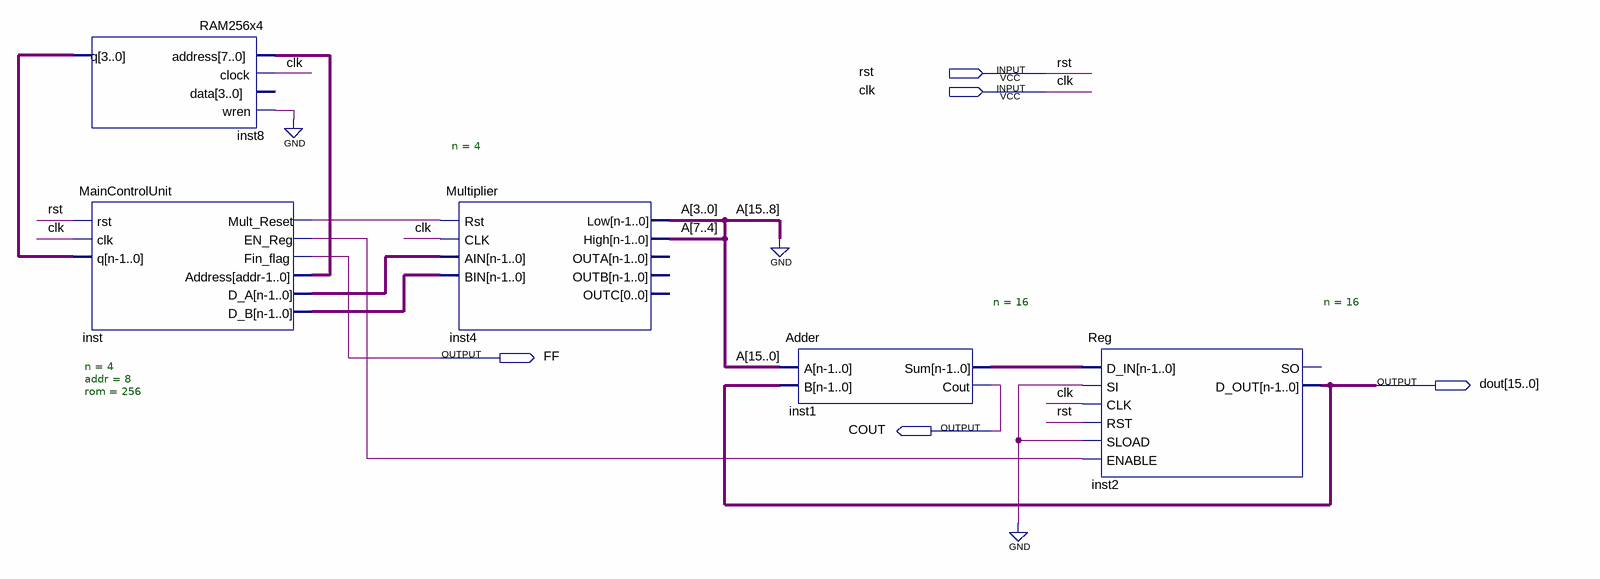
[diagram p0: schematic sheet]
// Quartus schematic Vector_multiplier_sum.bak.bdf as structural Verilog: 5 symbols, 5 pins
module \Vector_multiplier_sum.bak  (
  input  rst,
  input  clk,
  output FF,
  output [15:0] dout,
  output COUT
);

  wire inst_en_reg, inst_mult_reset;
  wire [3:0] inst8_q, inst_d_a, inst_d_b;
  wire [7:0] A, inst_address;
  wire [15:0] inst1_sum;

  RAM256x4 inst8 (.address(inst_address), .clock(clk), .wren(1'b0), .q(inst8_q));  // open: data
  MainControlUnit #(.n(4), .addr(8), .rom(256)) inst (
    .rst(rst), .clk(clk), .q(inst8_q), .Mult_Reset(inst_mult_reset), .EN_Reg(inst_en_reg), .Fin_flag(FF),
    .Address(inst_address), .D_A(inst_d_a), .D_B(inst_d_b));
  Multiplier #(.n(4)) inst4 (
    .Rst(inst_mult_reset), .CLK(clk), .AIN(inst_d_a), .BIN(inst_d_b), .Low(A[3:0]), .High(A[7:4]));  // open: OUTA, OUTB, OUTC
  Adder #(.n(16)) inst1 (.A({{8{1'b0}}, A}), .B(dout), .Sum(inst1_sum), .Cout(COUT));
  Reg #(.n(16)) inst2 (
    .D_IN(inst1_sum), .SI(1'b0), .CLK(clk), .RST(rst), .SLOAD(1'b0), .ENABLE(inst_en_reg), .D_OUT(dout));  // open: SO
endmodule
